# Altium schematic sheet Sheet1.SchDoc
size A
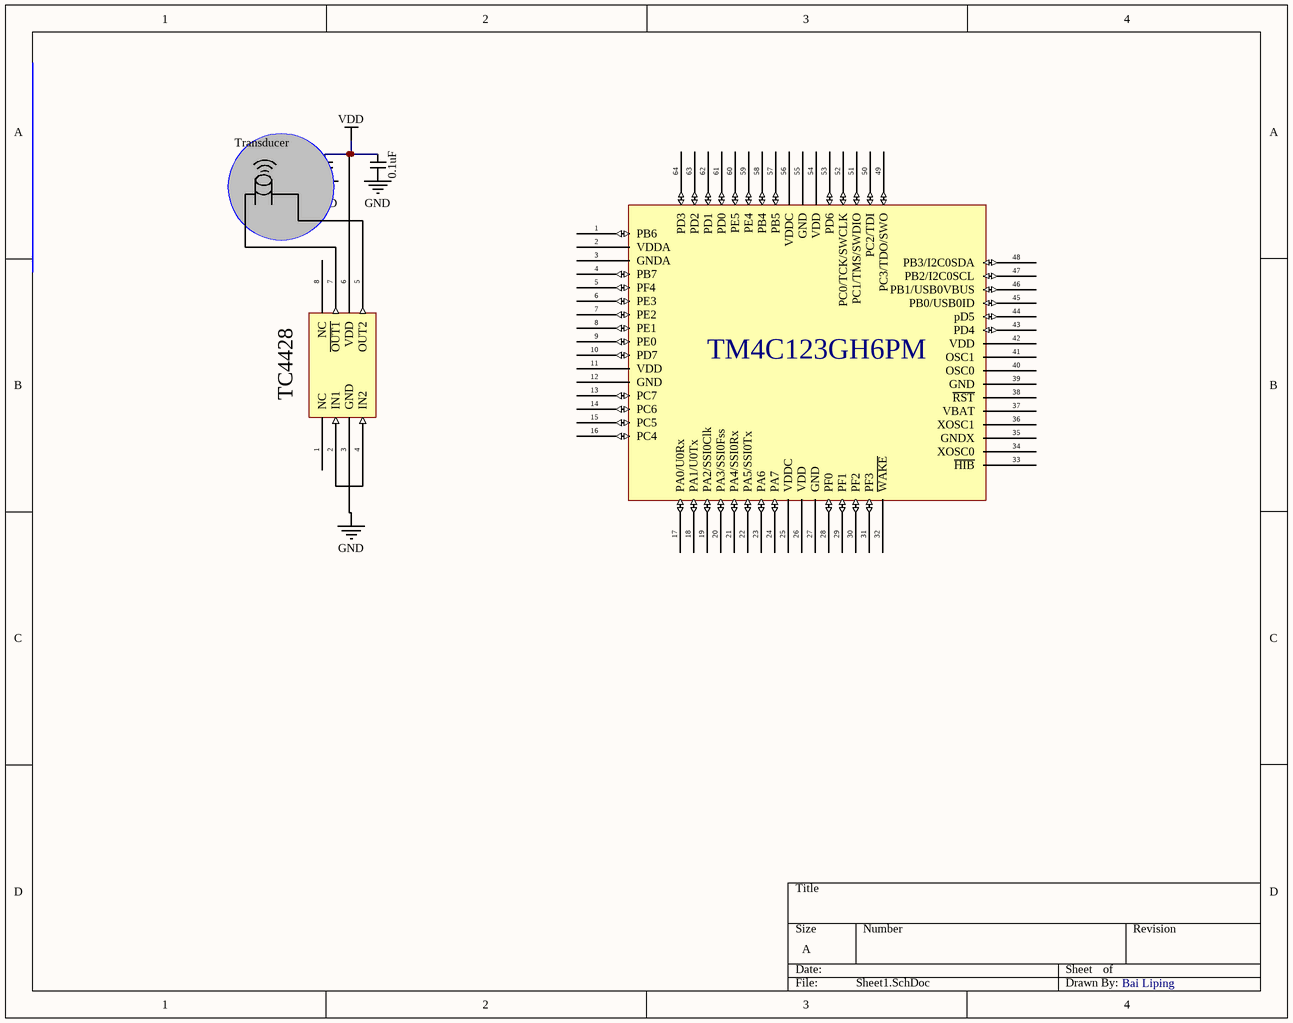
[diagram p0: Sheet1.SchDoc]

## Parts
(Parts that share a designator on the sheet are numbered #1, #2 ... from top to bottom, then left to right.)
*3  TM4C123GH6PM  (value not drawn)
*?#1  4.7uF
*?#2  0.1uF
*?#3  Transducer
*?#4  TC4428

## Nets
GND: *?#1.?2 *?#2.?2 *?#4.3(GND)
VDD: *?#1.?1 *?#2.?1 *?#4.6(VDD)
Net*?#3_?1: *?#3.?1 *?#4.5(OUT2)
Net*?#3_?2: *?#3.?2 *?#4.7(~{OUT1})
Net*?#4_2: *?#4.2(IN1) *?#4.4(IN2)

Not connected (* = marked no-connect by the designer): *3 1(PB6) 2(VDDA) 3(GNDA) 4(PB7) 5(PF4) 6(PE3) 7(PE2) 8(PE1) 9(PE0) 10(PD7) 11(VDD) 12(GND) 13(PC7) 14(PC6) 15(PC5) 16(PC4) 17(PA0/U0Rx) 18(PA1/U0Tx) 19(PA2/SSI0Clk) 20(PA3/SSI0Fss) 21(PA4/SSI0Rx) 22(PA5/SSI0Tx) 23(PA6) 24(PA7) 25(VDDC) 26(VDD) 27(GND) 28(PF0) 29(PF1) 30(PF2) 31(PF3) 32(~{WAKE}) 33(~{HIB}) 34(XOSC0) 35(GNDX) 36(XOSC1) 37(VBAT) 38(~{RST}) 39(GND) 40(OSC0) 41(OSC1) 42(VDD) 43(PD4) 44(pD5) 45(PB0/USB0ID) 46(PB1/USB0VBUS) 47(PB2/I2C0SCL) 48(PB3/I2C0SDA) 49(PC3/TDO/SWO) 50(PC2/TDI) 51(PC1/TMS/SWDIO) 52(PC0/TCK/SWCLK) 53(PD6) 54(VDD) 55(GND) 56(VDDC) 57(PB5) 58(PB4) 59(PE4) 60(PE5) 61(PD0) 62(PD1) 63(PD2) 64(PD3); *?#4 1(NC) 8(NC)

## Notes on the sheet
- Bai Liping

## Library data of the parts
*3 = TM4C123GH6PM: IC MCU 32BIT 256KB FLASH 64LQFP
*?#1 *?#2 = Capacitor
*?#4 = TC4428: Dual High-Speed Power MOSFET Drivers